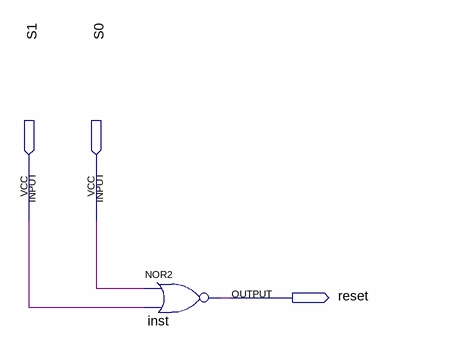
[diagram p0: schematic sheet]
// Quartus schematic saida_reset.bdf as structural Verilog: 1 symbols, 3 pins
module saida_reset (
  input  S1,
  input  S0,
  output reset
);

  nor inst (reset, S0, S1);
endmodule
